# Altium schematic sheet MAIN.SchDoc: Node ABZ (part 2 of 2)
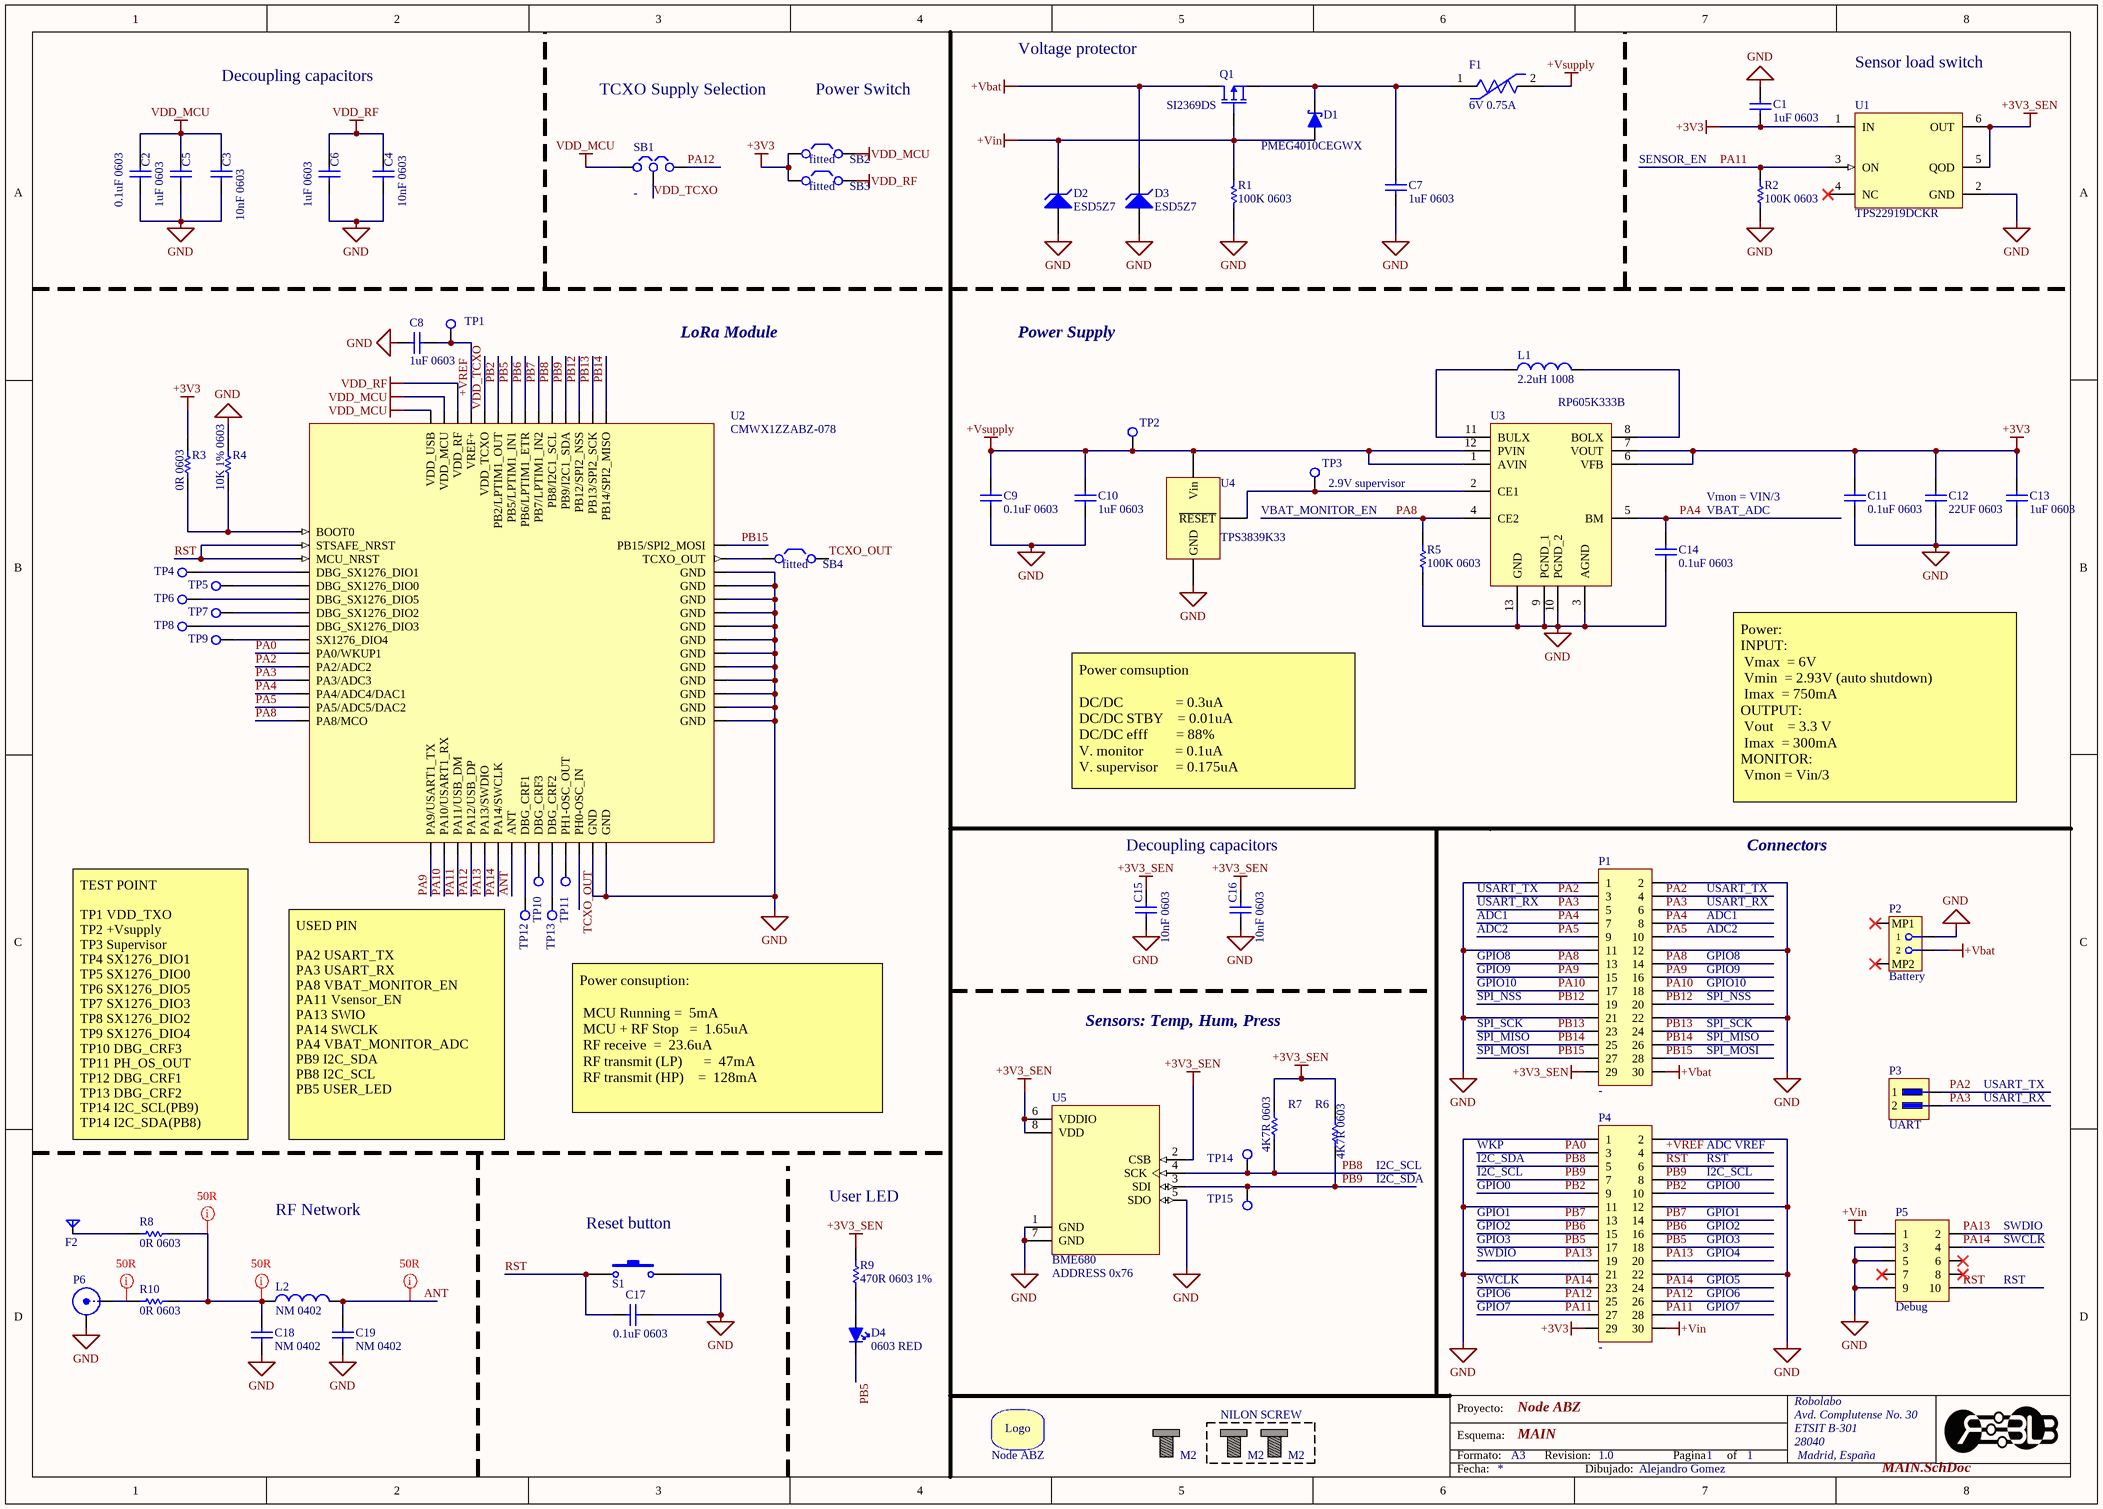
[diagram p1: MAIN.SchDoc]

## Library data of the parts
C1 C5-C8 C10 C13 = C0603C105K8PACTU: CAP CER, 1UF, 10V, X5R, 10%, 0603; Manufacturer: KEMET; Dielectric Material: Ceramic; Supplier 1: Digi-Key; Supplier Part Number 1: 399-3118-1-ND; Manufacturer Part Number: C0603C105K8PACTU; RoHS: Yes; Category: Ceramic Capacitors; Stock 1: 39312; Pricing 1: 1=0.10000, 10=0.05900, 50=0.03200, 100=0.02610, 500=0.01864, 1000=0.01464 (USD); Mount: Surface Mount; Case/Package: 0603; Number of Pins: 2; Weight: 7.1E-05oz; Case Code (Imperial): 0603; Case Code (Metric): 1608; Min Operating Temperature: -55°C; Max Operating Temperature: 85°C; Tolerance: 10%; Capacitance: 1uF; Packaging: Tape and Reel; Dielectric: X5R; Package Quantity: 1; Voltage Rating: 10V; Voltage Rating (DC): 10V; Termination: SMD/SMT; Voltage: 10V; Length: 1.6mm; Height: 0.8mm; Depth: 0.8mm; Width: 0.031inch; Thickness: 0.035inch; Radiation Hardening: No; REACH SVHC: No SVHC; Lead Free: Lead Free; ComponentLink1URL: https://datasheet.ciiva.com/11787/0900766b8116eb59-11787747.pdf?src-supplier=RSComponents; ComponentLink1Description: https://datasheet.ciiva.com/11787/0900766b8116eb59-11787747.pdf?src-supplier=RSComponents; ComponentLink2URL: https://datasheet.ciiva.com/6074/40889-6074647.pdf?src-supplier=Farnell; ComponentLink2Description: https://datasheet.ciiva.com/6074/40889-6074647.pdf?src-supplier=Farnell; ComponentLink3URL: https://datasheet.ciiva.com/28645/1831760-28645655.pdf?src-supplier=Element14; ComponentLink3Description: https://datasheet.ciiva.com/28645/1831760-28645655.pdf?src-supplier=Element14; ComponentLink4URL: https://datasheet.ciiva.com/26847/getdatasheetpartid-385480-26847548.pdf?src-supplier=Verical; ComponentLink4Description: https://datasheet.ciiva.com/26847/getdatasheetpartid-385480-26847548.pdf?src-supplier=Verical; ComponentLink5URL: https://datasheet.ciiva.com/7823/40889-7823998.pdf?src-supplier=Element14; ComponentLink5Description: https://datasheet.ciiva.com/7823/40889-7823998.pdf?src-supplier=Element14; ComponentLink6URL: https://datasheet.ciiva.com/7823/1929483-7823999.pdf?src-supplier=Element14; ComponentLink6Description: https://datasheet.ciiva.com/7823/1929483-7823999.pdf?src-supplier=Element14
C2 C17 = C0603C104K9RACTU: Cap Ceramic 0.1uF 6.3V X7R 10% Pad SMD 0603 125°C T/R; Manufacturer 1: KEMET; Capacitance: 100nF; Dissipation Factor: 5%; Supplier 1: Mouser; Manufacturer Part Number 1: C0603C104K9RACTU; RoHS: Yes; Category: Ceramic Capacitors; Stock 1: 22809; Pricing 1: 1=0,19000, 10=0,13800, 100=0,04500, 1000=0,03700, 4000=0,02700, 8000=0,02400 (USD); Mount: Surface Mount; Case/Package: 0603; Case Code (Imperial): 0603; Case Code (Metric): 1608; Dielectric Material: Ceramic; Min Operating Temperature: -55°C; Max Operating Temperature: 125°C; Package Quantity: 4000; Voltage Rating: 6.3V; Tolerance: 10%; Packaging: Tape and Reel; Voltage Rating (DC): 6.3V; Dielectric: X7R; Termination: SMD/SMT; Length: 1.6mm; Height: 0.8mm; Width: 0.8mm; Depth: 0.8mm; Thickness: 0.034inch; Radiation Hardening: No; ComponentLink1URL: https://datasheet.ciiva.com/13371/kem-c1002-x7r-smd-357932-13371879.pdf?src-supplier=Mouser; ComponentLink1Description: https://datasheet.ciiva.com/13371/kem-c1002-x7r-smd-357932-13371879.pdf?src-supplier=Mouser; Supplier Part Number 1: 80-C0603C104K9R
C3 C4 C15 C16 = C0603C103K5RACTU: Multilayer Ceramic Capacitor, C Series, 0.01 - F, - 10%, X7R, 50 V, 0603 [1608 Metric] ;RoHS Compliant: Yes; Manufacturer: KEMET; Voltage Rating: 50V; Dissipation Factor: 2.5%; Supplier 1: Digi-Key; RoHS: Yes; Category: Ceramic Capacitors; Stock 1: 2415850; Pricing 1: 1=0.11000, 10=0.07700, 50=0.04220, 100=0.03440, 500=0.02456, 1000=0.01930 (USD); Mount: Surface Mount,PCB; Case/Package: 0603; Case Code (Metric): 1608; Case Code (Imperial): 0603; Dielectric Material: Ceramic; Min Operating Temperature: -55°C; Max Operating Temperature: 125°C; Capacitance: 10nF; Tolerance: 10%; Packaging: Tape and Reel; Package Quantity: 4000; Voltage Rating (DC): 50V; Dielectric: X7R; Termination: SMD/SMT; Length: 1.6mm; Height: 0.8mm; Width: 0.8mm; Depth: 0.8mm; Thickness: 0.034inch; ComponentLink1URL: https://datasheet.ciiva.com/7823/1732718-7823585.pdf?src-supplier=Element14; ComponentLink1Description: https://datasheet.ciiva.com/7823/1732718-7823585.pdf?src-supplier=Element14; Supplier Part Number 1: 399-1091-1-ND; Manufacturer Part Number: C0603C103K5RACTU; Number of Pins: 2; Contact Plating: Tin,Matte; Voltage: 50V; Lead Pitch: 0.7mm; Radiation Hardening: No; REACH SVHC: No SVHC; ComponentLink2URL: https://datasheet.ciiva.com/5904/kem-c1002-x7r-smd-5904645.pdf?src-supplier=Farnell; ComponentLink2Description: https://datasheet.ciiva.com/5904/kem-c1002-x7r-smd-5904645.pdf?src-supplier=Farnell; ComponentLink3URL: https://datasheet.ciiva.com/18192/getdatasheetpartid-308803-18192662.pdf?src-supplier=Verical; ComponentLink3Description: https://datasheet.ciiva.com/18192/getdatasheetpartid-308803-18192662.pdf?src-supplier=Verical; ComponentLink4URL: https://datasheet.ciiva.com/39122/kem-c1002-x7r-smd-39122903.pdf?src-supplier=Onlinecomponents.com; ComponentLink4Description: https://datasheet.ciiva.com/39122/kem-c1002-x7r-smd-39122903.pdf?src-supplier=Onlinecomponents.com; ComponentLink5URL: https://datasheet.ciiva.com/7823/kem-c1002-x7r-smd-7823976.pdf?src-supplier=Element14; ComponentLink5Description: https://datasheet.ciiva.com/7823/kem-c1002-x7r-smd-7823976.pdf?src-supplier=Element14; ComponentLink6URL: https://datasheet.ciiva.com/7823/kem-c1002-x7r-smd-7823977.pdf?src-supplier=Element14; ComponentLink6Description: https://datasheet.ciiva.com/7823/kem-c1002-x7r-smd-7823977.pdf?src-supplier=Element14; ComponentLink7URL: https://datasheet.ciiva.com/7823/1918693-7823978.pdf?src-supplier=Element14; ComponentLink7Description: https://datasheet.ciiva.com/7823/1918693-7823978.pdf?src-supplier=Element14; ComponentLink8URL: https://datasheet.ciiva.com/14585/70095383-14585450.pdf?src-supplier=Allied+Electronics; ComponentLink8Description: https://datasheet.ciiva.com/14585/70095383-14585450.pdf?src-supplier=Allied+Electronics; ComponentLink9URL: https://datasheet.ciiva.com/18101/getdatasheetpartid-58468-18101898.pdf?src-supplier=Verical; ComponentLink9Description: https://datasheet.ciiva.com/18101/getdatasheetpartid-58468-18101898.pdf?src-supplier=Verical; ComponentLink10URL: https://datasheet.ciiva.com/5416/kem-c1002-x7r-smd-5416028.pdf?src-supplier=Mouser; ComponentLink10Description: https://datasheet.ciiva.com/5416/kem-c1002-x7r-smd-5416028.pdf?src-supplier=Mouser; ComponentLink11URL: https://datasheet.ciiva.com/28645/1851736-28645598.pdf?src-supplier=Element14; ComponentLink11Description: https://datasheet.ciiva.com/28645/1851736-28645598.pdf?src-supplier=Element14
C9 C11 C14 = C0603C104K9RACTU: CAP CER, 0.1UF, 6.3V, X7R, 10%, 0603; Manufacturer 1: KEMET; Dielectric Material: Ceramic; Capacitance: 100nF; Dissipation Factor: 5%; Supplier 1: Mouser; Manufacturer Part Number 1: C0603C104K9RACTU; RoHS: Yes; Category: Ceramic Capacitors; Stock 1: 22809; Pricing 1: 1=0,19000, 10=0,13800, 100=0,04500, 1000=0,03700, 4000=0,02700, 8000=0,02400 (USD); Mount: Surface Mount; Case/Package: 0603; Case Code (Imperial): 0603; Case Code (Metric): 1608; Min Operating Temperature: -55°C; Max Operating Temperature: 125°C; Package Quantity: 4000; Voltage Rating: 6.3V; Tolerance: 10%; Packaging: Tape and Reel; Voltage Rating (DC): 6.3V; Dielectric: X7R; Termination: SMD/SMT; Length: 1.6mm; Height: 0.8mm; Width: 0.8mm; Depth: 0.8mm; Thickness: 0.034inch; Radiation Hardening: No; ComponentLink1URL: https://datasheet.ciiva.com/13371/kem-c1002-x7r-smd-357932-13371879.pdf?src-supplier=Mouser; ComponentLink1Description: https://datasheet.ciiva.com/13371/kem-c1002-x7r-smd-357932-13371879.pdf?src-supplier=Mouser; Supplier Part Number 1: 80-C0603C104K9R
C12 = C0603C300G1HACTU: CAP CER, 22UF, 100V, X8R, 2%, 0603; Manufacturer: KEMET; Supplier 1: Mouser; Supplier Part Number 1: 80-C0603C300G1HACTU; Manufacturer Part Number: C0603C300G1HACTU; RoHS: Yes; Category: Ceramic Capacitors; Stock 1: 11458; Pricing 1: 1=0.04000, 10=0.02900, 50=0.02900, 100=0.02500, 1000=0.01400, 10000=0.01200 (USD); RoHS Compliant: Yes
C18 C19 = C0603C103K9RACTU: NM; Manufacturer 1: KEMET; Dielectric Material: Ceramic; Capacitance: 10nF; Tolerance: 10%; Voltage Rating: 6.3V; Dielectric: X7R; Dissipation Factor: 5%; Supplier 1: Mouser; Manufacturer Part Number 1: C0603C103K9RACTU; RoHS: Yes; Category: Ceramic Capacitors; Stock 1: 18988; Pricing 1: 1=0,11000, 10=0,07600, 100=0,02400, 1000=0,02000, 4000=0,01600, 8000=0,01400 (USD); Mount: Surface Mount; Case/Package: 0603; Case Code (Metric): 1608; Case Code (Imperial): 0603; Min Operating Temperature: -55°C; Max Operating Temperature: 125°C; Packaging: Tape and Reel; Package Quantity: 1; Voltage Rating (DC): 6.3V; Termination: SMD/SMT; Length: 1.6mm; Height: 0.8mm; Width: 0.031inch; Depth: 0.8mm; Thickness: 0.034inch; ComponentLink1URL: https://datasheet.ciiva.com/5421/kem-c1002-x7r-smd-357932-5421815.pdf?src-supplier=Mouser; ComponentLink1Description: https://datasheet.ciiva.com/5421/kem-c1002-x7r-smd-357932-5421815.pdf?src-supplier=Mouser; Supplier Part Number 1: 80-C0603C103K9R
D1 = PMEG4010CEGWX: DIODE SCHOTTKY 40V 1A 570mV SOD123; Manufacturer: Nexperia; Supplier 1: Mouser; Supplier Part Number 1: 841-PMEG4010CEGWX; Manufacturer Part Number: PMEG4010CEGWX; RoHS: No; Category: Schottky Diodes; Stock 1: 3187; Pricing 1: 1=0.29000, 10=0.19400, 50=0.19400, 100=0.09100, 1000=0.05400, 10000=0.03500 (USD); RoHS Compliant: No; ComponentLink1URL: http://www.farnell.com/datasheets/2290154.pdf?src-supplier=Farnell; ComponentLink1Description: http://www.farnell.com/datasheets/2290154.pdf?src-supplier=Farnell; ComponentLink2URL: https://assets.nexperia.com/documents/data-sheet/PMEG4010CEGW.pdf?src-supplier=Digi-Key; ComponentLink2Description: https://assets.nexperia.com/documents/data-sheet/PMEG4010CEGW.pdf?src-supplier=Digi-Key; ComponentLink3URL: http://www.farnell.com/datasheets/2290154.pdf?src-supplier=Element14; ComponentLink3Description: http://www.farnell.com/datasheets/2290154.pdf?src-supplier=Element14; ComponentLink4URL: http://www.farnell.com/datasheets/2290154.pdf?src-supplier=Newark; ComponentLink4Description: http://www.farnell.com/datasheets/2290154.pdf?src-supplier=Newark
D2 D3 = ESD5Z7.0T1G: TVS Diodes / ESD Suppressors SOD523 ESD DIODE; Manufacturer: ON Semiconductor; Operating Supply Voltage: 7V; Number of Elements: 1; Capacitance: 65pF; Reverse Breakdown Voltage: 7.5V; Max Surge Current: 8.8A; Direction: Unidirectional; Clamping Voltage: 22.7V; Peak Pulse Power: 200W; Power Line Protection: No; ESD Protection: Yes; Max Reverse Leakage Current: 10nA; Test Current: 1mA; Max Power Dissipation: 240W; Element Configuration: Single; Diode Type: ZENER; Supplier 1: Mouser; Supplier Part Number 1: 863-ESD5Z7.0T1G; Manufacturer Part Number: ESD5Z7.0T1G; RoHS: Yes; Category: ESD and Circuit Protection ICs; Stock 1: 23017; Pricing 1: 1=0.17000, 10=0.11700, 50=0.11700, 100=0.05000, 1000=0.03500, 10000=0.02300 (USD); Case/Package: SOD-523-2; Number of Pins: 2; Contact Plating: Tin,Matte; Min Operating Temperature: -55°C; Max Operating Temperature: 150°C; Package Quantity: 1; Number of Channels: 1; Packaging: Tape and Reel; Number of Unidirectional Channels: 1; Reverse Standoff Voltage: 7V; Min Breakdown Voltage: 7.5V; Polarity: Unidirectional; Breakdown Voltage: 7.5V; Termination: SMD/SMT; Working Voltage: 7V; Max Breakdown Voltage: 7.5V; Leakage Current: 10nA; Peak Pulse Current: 8.8A; Number of Lines: 1; Resistor Type: Zener; Series: Automotive, AEC-Q101; Clamping Voltage-Max: 22.7V; Length: 1.2mm; Width: 0.9mm; Height: 0.7mm; Depth: 0.8mm; Radiation Hardening: No; REACH SVHC: No SVHC; Lead Free: Lead Free; Halogen Free: Halogen Free; RoHS Compliant: Yes; ComponentLink1URL: https://datasheet.ciiva.com/353/esd5z2-5t1-d-353760.pdf?src-supplier=Digi-Key; ComponentLink1Description: https://datasheet.ciiva.com/353/esd5z2-5t1-d-353760.pdf?src-supplier=Digi-Key; ComponentLink2URL: https://datasheet.ciiva.com/30478/0900766b8125092b-30478674.pdf?src-supplier=RSComponents; ComponentLink2Description: https://datasheet.ciiva.com/30478/0900766b8125092b-30478674.pdf?src-supplier=RSComponents; ComponentLink3URL: https://datasheet.ciiva.com/353/esd5z2-5t1-d-353761.pdf?src-supplier=Digi-Key; ComponentLink3Description: https://datasheet.ciiva.com/353/esd5z2-5t1-d-353761.pdf?src-supplier=Digi-Key; ComponentLink4URL: https://datasheet.ciiva.com/11195/esd5z2-5t1-d-11195333.pdf?src-supplier=Avnet; ComponentLink4Description: https://datasheet.ciiva.com/11195/esd5z2-5t1-d-11195333.pdf?src-supplier=Avnet; ComponentLink5URL: https://datasheet.ciiva.com/16437/esd5z2-5t1-d-16437829.pdf?src-supplier=Future+Electronics; ComponentLink5Description: https://datasheet.ciiva.com/16437/esd5z2-5t1-d-16437829.pdf?src-supplier=Future+Electronics; ComponentLink6URL: https://datasheet.ciiva.com/7973/esd5z2-5t1-d-7973851.pdf?src-supplier=Element14; ComponentLink6Description: https://datasheet.ciiva.com/7973/esd5z2-5t1-d-7973851.pdf?src-supplier=Element14; ComponentLink7URL: https://datasheet.ciiva.com/26817/getdatasheetpartid-120991-26817819.pdf?src-supplier=Verical; ComponentLink7Description: https://datasheet.ciiva.com/26817/getdatasheetpartid-120991-26817819.pdf?src-supplier=Verical; ComponentLink8URL: https://datasheet.ciiva.com/353/esd5z2-5t1-d-353759.pdf?src-supplier=Digi-Key; ComponentLink8Description: https://datasheet.ciiva.com/353/esd5z2-5t1-d-353759.pdf?src-supplier=Digi-Key
D4 = KPG1-1608SURC-TT: Led, Red, 65MCD, 631NM, SMD, 1608; Manufacturer: Kingbright; Supplier 1: RSComponents; RoHS: No; Stock 1: 2675; Pricing 1: 25=0.16500 (USD); ComponentLink1URL: http://www.farnell.com/datasheets/2163487.pdf?src-supplier=Farnell; ComponentLink1Description: http://www.farnell.com/datasheets/2163487.pdf?src-supplier=Farnell; Supplier Part Number 1: 1254508; Manufacturer Part Number: KPG1-1608SURC-TT
F1 = 0ZCK0075FF2E: BEL FUSE - 0ZCK0075FF2E - FUSE, RESETTABLE PTC, 6VDC, 0.75A, SMD; Max Current Rating: 40A; Hold Current: 750mA; Trip Current: 1.5A; Time to Trip: 0.2s; Supplier 1: Mouser; Supplier Part Number 1: 530-0ZCK0075FF2E; Manufacturer: Bel; RoHS: Yes; Category: PTC Resettable Fuses; Stock 1: 8730; Pricing 1: 1=0.17000, 10=0.17000, 50=0.12300, 100=0.10900, 1000=0.08600, 10000=0.07300 (USD); Case/Package: 0805; Case Code (Metric): 2012; Case Code (Imperial): 0805; Package Quantity: 1; Packaging: Tape and Reel; Lead Free: Lead Free; RoHS Compliant: Yes; ComponentLink1URL: https://datasheet.ciiva.com/18550/0zck-18550716.pdf?src-supplier=Digi-Key; ComponentLink1Description: https://datasheet.ciiva.com/18550/0zck-18550716.pdf?src-supplier=Digi-Key; ComponentLink2URL: https://datasheet.ciiva.com/18550/0zck-18550717.pdf?src-supplier=Digi-Key; ComponentLink2Description: https://datasheet.ciiva.com/18550/0zck-18550717.pdf?src-supplier=Digi-Key; Manufacturer Part Number: 0ZCK0075FF2E
F2 = Helical_868-915MHZ: 19x11mm Helical antenna. Requieres load matching  (impedance at 868MHz: 10-88j, VSWR 22)
L1 = CVH252009-2R2M: 2.2uH, 1.3A , 20%, 1MHz; Manufacturer: Bourns; Core Material: Ferrite; Shielding: Shielded; Self Resonant Frequency: 40MHz; DC Resistance (DCR): 80mR; Supplier 1: Mouser; Supplier Part Number 1: 652-CVH252009-2R2M; Manufacturer Part Number: CVH252009-2R2M; RoHS: Yes; Category: Fixed Inductors; Stock 1: 41990; Pricing 1: 1=0.23000, 10=0.18800, 50=0.16900, 100=0.15800, 1000=0.11100, 10000=0.08000 (USD); Mount: Surface Mount; Case/Package: 1008; Case Code (Metric): 2520; Case Code (Imperial): 1008; Contact Plating: Tin; Min Operating Temperature: -55°C; Max Operating Temperature: 125°C; Package Quantity: 3000; Current Rating: 1.3A; Tolerance: 20%; Packaging: Tape and Reel; Inductance Tolerance: 20%; Inductance: 2.2uH; Test Frequency: 1MHz; Max DC Current: 1.3A; Termination: SMD/SMT; DC Current: 1.3A; Series: CVH252009; Length: 0.098inch; Width: 0.079inch; Height - Seated (Max): 0.039inch; Depth: 2.2mm; REACH SVHC: No SVHC; Military Standard: Not; RoHS Compliant: Yes; ComponentLink1URL: https://datasheet.ciiva.com/6703/cvh25200920series-6703456.pdf?src-supplier=Digi-Key; ComponentLink1Description: https://datasheet.ciiva.com/6703/cvh25200920series-6703456.pdf?src-supplier=Digi-Key; ComponentLink2URL: https://datasheet.ciiva.com/3079/cvh-3079746.pdf?src-supplier=Avnet; ComponentLink2Description: https://datasheet.ciiva.com/3079/cvh-3079746.pdf?src-supplier=Avnet; ComponentLink3URL: https://datasheet.ciiva.com/7849/1610598-7849317.pdf?src-supplier=Element14; ComponentLink3Description: https://datasheet.ciiva.com/7849/1610598-7849317.pdf?src-supplier=Element14; ComponentLink4URL: https://datasheet.ciiva.com/22874/70301233-22874395.pdf?src-supplier=Allied+Electronics; ComponentLink4Description: https://datasheet.ciiva.com/22874/70301233-22874395.pdf?src-supplier=Allied+Electronics; ComponentLink5URL: https://datasheet.ciiva.com/6703/cvh252009series-6703455.pdf?src-supplier=Digi-Key; ComponentLink5Description: https://datasheet.ciiva.com/6703/cvh252009series-6703455.pdf?src-supplier=Digi-Key
L2 = 2506031217Z0: NM; Manufacturer: Fair-Rite; Impedance: 120 Ohms; Maximum DC Current: 450 mA; Maximum DC Resistance: 300 mOhms; Tolerance: 25 %; Type: Multilayer Ferrite Chip Bead; Test Frequency: 100 MHz; Supplier 1: Mouser; Manufacturer Part Number: 2506031217Z0; RoHS: RoHS Compliant; Category: Ferrite Beads; Stock 1: 9619; Pricing 1: 1=0.032, 2500=0.027, 4000=0.025, 8000=0.024, 24000=0.022, 48000=0.021, 100000=0.018, 400000=0.016 (EUR); Capacitance: -; Height: 0.8 mm; Length: 1.6 mm; Operating Temperature Range: - 55 C to + 125 C; Package / Case: 0603 (1608 metric); Packaging: Cut Tape; Product: Ferrite Chip Beads; Termination Style: SMD/SMT; Width: 0.8 mm; Brand: Fair-Rite; Maximum Operating Temperature: + 125 C; Minimum Operating Temperature: - 55 C; Product Type: Ferrite Beads; Standard Pack Qty: 4000; Subcategory: Ferrites; Termination: -; RoHS - Mouser: Y; Minimum Order Quantity: 1; Reeling: True; ComponentLink1URL: https://www.mouser.com/datasheet/2/150/2506031217Z0-471794.pdf; ComponentLink1Description: https://www.mouser.com/datasheet/2/150/2506031217Z0-471794.pdf; Supplier Part Number 1: 623-2506031217Z0
logo1 = Robolabo
P1 P4 = CONN-2X15-1.27-MALE-RECT
P2 = S2B-PH-SM4-TB: CONN MALE RECT 2 POS 2mm
P3 = CONN-1X2-2.54-PCB
P5 = CONN-2X5-1.27-MALE-RECT
P6 = 73412-0110: MOLEX   73412-0110   RF COAXIAL, MICROCOAXIAL, JACK, 50OHM; Impedance: 50R; Voltage Rating: 60V; Frequency: 6GHz; Gender: Female; Polarity: Standard; Body Material: Polymer,Liquid Crystal Polymer; Body Plating: Gold; Insulation Resistance: 500MR; Mating Cycles: 30; Supplier 1: Digi-Key; Stock 1: 98770; Pricing 1: 1=0.77000, 10=0.72200, 25=0.64960, 50=0.57740, 100=0.55330, 250=0.50520, 500=0.48114, 1000=0.39694, 2500=0.36086 (USD); RoHS: Yes; ComponentLink1URL: https://datasheet.ciiva.com/30219/250360734120110-rf-coax-nectors-30219809.pdf?src-supplier=Onlinecomponents.com; ComponentLink1Description: https://datasheet.ciiva.com/30219/250360734120110-rf-coax-nectors-30219809.pdf?src-supplier=Onlinecomponents.com; Supplier Part Number 1: WM5587CT-ND; Manufacturer: Molex; Manufacturer Part Number: 73412-0110; Category: RF / Coaxial Connectors; Mount: Surface Mount,Through Hole,PCB; Contact Material: Bronze,Brass; Contact Plating: Gold; Min Operating Temperature: -40°C; Max Operating Temperature: 90°C; Package Quantity: 5000; Packaging: Tape and Reel; Termination: Solder; Connector Type: Coaxial; Orientation: Straight; Voltage Rating (AC): 60V; Radiation Hardening: No; REACH SVHC: Unknown; Lead Free: Lead Free; ComponentLink2URL: https://datasheet.ciiva.com/16653/0734120110-rf-coax-connectors-16653186.pdf?src-supplier=Avnet+Europe; ComponentLink2Description: https://datasheet.ciiva.com/16653/0734120110-rf-coax-connectors-16653186.pdf?src-supplier=Avnet+Europe; ComponentLink3URL: https://datasheet.ciiva.com/11762/0900766b80dfdeb4-11762356.pdf?src-supplier=RSComponents; ComponentLink3Description: https://datasheet.ciiva.com/11762/0900766b80dfdeb4-11762356.pdf?src-supplier=RSComponents; ComponentLink4URL: https://datasheet.ciiva.com/22773/1841262-22773140.pdf?src-supplier=Farnell; ComponentLink4Description: https://datasheet.ciiva.com/22773/1841262-22773140.pdf?src-supplier=Farnell; ComponentLink5URL: https://datasheet.ciiva.com/4600/0734120110-rf-coax-connectors-173239-4600647.pdf?src-supplier=Mouser; ComponentLink5Description: https://datasheet.ciiva.com/4600/0734120110-rf-coax-connectors-173239-4600647.pdf?src-supplier=Mouser; ComponentLink6URL: https://datasheet.ciiva.com/16081/1387750734120110-rf-coax-nectors-16081145.pdf?src-supplier=Onlinecomponents.com; ComponentLink6Description: https://datasheet.ciiva.com/16081/1387750734120110-rf-coax-nectors-16081145.pdf?src-supplier=Onlinecomponents.com; ComponentLink7URL: https://datasheet.ciiva.com/46384/1808577-46384459.pdf?src-supplier=Element14; ComponentLink7Description: https://datasheet.ciiva.com/46384/1808577-46384459.pdf?src-supplier=Element14; ComponentLink8URL: https://datasheet.ciiva.com/9419/0734120110-rf-coax-connectors-9419357.pdf?src-supplier=Avnet; ComponentLink8Description: https://datasheet.ciiva.com/9419/0734120110-rf-coax-connectors-9419357.pdf?src-supplier=Avnet; Halogen Free: Low Halogen; Material: Bronze; Max Frequency: 6GHz
Q1 = SI2369DS-T1-GE3: VISHAY - SI2369DS-T1-GE3 - MOSFET, P-CH, -30V, -7.6A, 150DEG C; Manufacturer: Vishay Siliconix; Drain to Source Voltage (Vdss): 30V; Max Power Dissipation: 2.5W; Number of Channels: 1; Drain to Source Resistance: 29mR; Input Capacitance: 1.295nF; Gate to Source Voltage (Vgs): 20V; Supplier 1: Mouser; Supplier Part Number 1: 78-SI2369DS-T1-GE3; Manufacturer Part Number: SI2369DS-T1-GE3; RoHS: Yes; Category: MOSFETs; Stock 1: 37245; Pricing 1: 1=0.36000, 10=0.32600, 100=0.24200, 500=0.19900, 1000=0.15300, 3000=0.14000 (USD); Mount: Surface Mount; Case/Package: TO-236-3; Number of Pins: 3; Contact Plating: Tin,Matte; Min Operating Temperature: -55°C; Max Operating Temperature: 150°C; Continuous Drain Current (ID): -7.6A; Drain to Source Breakdown Voltage: 30V; Package Quantity: 3000; Packaging: Tape and Reel; Rds On Max: 29mR; Radiation Hardening: No; REACH SVHC: No SVHC; ComponentLink1URL: https://datasheet.ciiva.com/29747/si2369d-29747874.pdf?src-supplier=Digi-Key; ComponentLink1Description: https://datasheet.ciiva.com/29747/si2369d-29747874.pdf?src-supplier=Digi-Key; ComponentLink2URL: https://datasheet.ciiva.com/29747/si2369d-29747879.pdf?src-supplier=Digi-Key; ComponentLink2Description: https://datasheet.ciiva.com/29747/si2369d-29747879.pdf?src-supplier=Digi-Key
R1 R2 R5 = CRCW0603100KFKEAHP: RES SMD 100K OHM 1% 1/10W 0603; Manufacturer: Vishay; Temperature Coefficient: 100ppm/°C; Resistance: 100kR; Max Power Dissipation: 250mW; Voltage Rating: 75V; Supplier 1: Digi-Key; Supplier Part Number 1: 541-100KSCT-ND; Manufacturer Part Number: CRCW0603100KFKEAHP; RoHS: Yes; Category: Chip SMD Resistors; Stock 1: 8564; Pricing 1: 1=0.16000, 10=0.13600, 100=0.05330, 1000=0.02232, 2500=0.02046 (USD); Case/Package: 0603; Weight: 7.1E-05oz; Contact Plating: Tin; Case Code (Imperial): 0603; Case Code (Metric): 1608; Min Operating Temperature: -55°C; Max Operating Temperature: 155°C; Tolerance: 1%; Composition: Thick Film; Features: Automotive AEC-Q200; Power Rating: 250mW; Packaging: Tape and Reel; Package Quantity: 10; Number of Terminations: 2; Termination: SMD/SMT; Military Standard: Not; Voltage Rating (DC): 75V; Length: 1.6mm; Height: 0.45mm; Width: 0.8mm; Depth: 0.85mm; Radiation Hardening: No; REACH SVHC: Unknown; Lead Free: Lead Free; ComponentLink1URL: https://datasheet.ciiva.com/3256/crcwhpe3-3256918.pdf?src-supplier=Avnet; ComponentLink1Description: https://datasheet.ciiva.com/3256/crcwhpe3-3256918.pdf?src-supplier=Avnet; ComponentLink2URL: https://datasheet.ciiva.com/2472/crcwhpe3-2472535.pdf?src-supplier=Digi-Key; ComponentLink2Description: https://datasheet.ciiva.com/2472/crcwhpe3-2472535.pdf?src-supplier=Digi-Key; ComponentLink3URL: https://datasheet.ciiva.com/2472/crcwhpe3-2472536.pdf?src-supplier=Digi-Key; ComponentLink3Description: https://datasheet.ciiva.com/2472/crcwhpe3-2472536.pdf?src-supplier=Digi-Key; ComponentLink4URL: https://datasheet.ciiva.com/16211/crcwhpe3-16211869.pdf?src-supplier=Future+Electronics; ComponentLink4Description: https://datasheet.ciiva.com/16211/crcwhpe3-16211869.pdf?src-supplier=Future+Electronics; ComponentLink5URL: https://datasheet.ciiva.com/7777/424479-7777270.pdf?src-supplier=Element14; ComponentLink5Description: https://datasheet.ciiva.com/7777/424479-7777270.pdf?src-supplier=Element14; ComponentLink6URL: https://datasheet.ciiva.com/7777/424479-7777271.pdf?src-supplier=Element14; ComponentLink6Description: https://datasheet.ciiva.com/7777/424479-7777271.pdf?src-supplier=Element14; ComponentLink7URL: https://datasheet.ciiva.com/2472/crcwhpe3-2472537.pdf?src-supplier=Digi-Key; ComponentLink7Description: https://datasheet.ciiva.com/2472/crcwhpe3-2472537.pdf?src-supplier=Digi-Key
R3 R8 R10 = CRCW0603-0000Z0EA: RES SMD 0 OHM 0603; Manufacturer 1: Vishay; Resistance: 0mR; Power Rating: 100mW; Voltage Rating: 75V; Temperature Coefficient: 100ppm/°C; Tolerance: 5%; Current Rating: 2A; Supplier 1: Mouser; Stock 1: 1187486; Pricing 1: 1=0,100000, 10=0,017000, 100=0,012000, 500=0,007000, 1000=0,006000, 2500=0,005000, 5000=0,004000, 10000=0,003000 (USD); RoHS: Yes; Case/Package: 0603; Weight: 7.1E-05oz; Case Code (Metric): 1608; Case Code (Imperial): 0603; Contact Plating: Tin,Lead; Min Operating Temperature: -55°C; Max Operating Temperature: 155°C; Packaging: Tape and Reel; Composition: Thick Film; Voltage Rating (DC): 75V; Military Standard: Not; Package Quantity: 1; Termination: SMD/SMT; Max Power Dissipation: 100mW; Number of Terminations: 2; Features: Automotive AEC-Q200; Length: 1.55mm; Height: 0.02inch; Width: 0.033inch; Depth: 0.85mm; Radiation Hardening: No; REACH SVHC: Unknown; Lead Free: Lead Free; ComponentLink1URL: https://datasheet.ciiva.com/2461/dcrcwe3-2461968.pdf?src-supplier=Digi-Key; ComponentLink1Description: https://datasheet.ciiva.com/2461/dcrcwe3-2461968.pdf?src-supplier=Digi-Key; ComponentLink2URL: https://datasheet.ciiva.com/2461/dcrcwe3-2461969.pdf?src-supplier=Digi-Key; ComponentLink2Description: https://datasheet.ciiva.com/2461/dcrcwe3-2461969.pdf?src-supplier=Digi-Key; ComponentLink3URL: https://datasheet.ciiva.com/2461/dcrcwe3-2461970.pdf?src-supplier=Digi-Key; ComponentLink3Description: https://datasheet.ciiva.com/2461/dcrcwe3-2461970.pdf?src-supplier=Digi-Key; ComponentLink4URL: https://datasheet.ciiva.com/8340/dcrcwe3-8340197.pdf?src-supplier=Avnet; ComponentLink4Description: https://datasheet.ciiva.com/8340/dcrcwe3-8340197.pdf?src-supplier=Avnet; ComponentLink5URL: https://datasheet.ciiva.com/16941/dcrcw-16941302.pdf?src-supplier=Avnet+Europe; ComponentLink5Description: https://datasheet.ciiva.com/16941/dcrcw-16941302.pdf?src-supplier=Avnet+Europe; Supplier Part Number 1: 71-CRCW0603-0-E3; Manufacturer Part Number 1: CRCW0603-0000Z0EA; Mount: Surface Mount; Working Voltage: 75V; ComponentLink6URL: https://datasheet.ciiva.com/16199/dcrcwe3-16199063.pdf?src-supplier=Future+Electronics; ComponentLink6Description: https://datasheet.ciiva.com/16199/dcrcwe3-16199063.pdf?src-supplier=Future+Electronics; ComponentLink7URL: https://datasheet.ciiva.com/16725/70201119-16725175.pdf?src-supplier=Allied+Electronics; ComponentLink7Description: https://datasheet.ciiva.com/16725/70201119-16725175.pdf?src-supplier=Allied+Electronics; ComponentLink8URL: https://datasheet.ciiva.com/26316/fld-crcw-e3-data-en-26316615.pdf?src-supplier=Distrelec; ComponentLink8Description: https://datasheet.ciiva.com/26316/fld-crcw-e3-data-en-26316615.pdf?src-supplier=Distrelec; ComponentLink9URL: https://datasheet.ciiva.com/5544/dcrcwe3-109170-5544344.pdf?src-supplier=Mouser; ComponentLink9Description: https://datasheet.ciiva.com/5544/dcrcwe3-109170-5544344.pdf?src-supplier=Mouser; ComponentLink10URL: https://datasheet.ciiva.com/7841/1720486-7841816.pdf?src-supplier=Element14; ComponentLink10Description: https://datasheet.ciiva.com/7841/1720486-7841816.pdf?src-supplier=Element14; ComponentLink11URL: https://datasheet.ciiva.com/7841/1720486-7841817.pdf?src-supplier=Element14; ComponentLink11Description: https://datasheet.ciiva.com/7841/1720486-7841817.pdf?src-supplier=Element14; ComponentLink12URL: https://datasheet.ciiva.com/7841/125364-7841818.pdf?src-supplier=Element14; ComponentLink12Description: https://datasheet.ciiva.com/7841/125364-7841818.pdf?src-supplier=Element14; ComponentLink13URL: https://datasheet.ciiva.com/16721/70201119-16721450.pdf?src-supplier=Allied+Electronics; ComponentLink13Description: https://datasheet.ciiva.com/16721/70201119-16721450.pdf?src-supplier=Allied+Electronics
R4 = CRCW060310K0FKEA: RES SMD 10K OHM 1% 1/10W 0603; Manufacturer: Vishay; Resistance: 10kR; Temperature Coefficient: 100ppm/°C; Voltage Rating (DC): 75V; Power Rating: 100mW; Supplier 1: Digi-Key; Stock 1: 633553; Pricing 1: 1=0.10000, 10=0.03300, 100=0.01340, 1000=0.00602, 2500=0.00522 (USD); RoHS: Yes; Case/Package: 0603; Number of Pins: 2; Weight: 7.1E-05oz; Case Code (Imperial): 0603; Case Code (Metric): 1608; Min Operating Temperature: -55°C; Max Operating Temperature: 155°C; Tolerance: 1%; Composition: Thick Film; Packaging: Tape and Reel; Military Standard: Not; Voltage Rating: 75V; Termination: SMD/SMT; Length: 1.55mm; Height: 0.45mm; Width: 0.033inch; Depth: 0.85mm; REACH SVHC: Unknown; Lead Free: Lead Free; ComponentLink1URL: https://datasheet.ciiva.com/11809/0900766b80d98afc-11809037.pdf?src-supplier=RSComponents; ComponentLink1Description: https://datasheet.ciiva.com/11809/0900766b80d98afc-11809037.pdf?src-supplier=RSComponents; ComponentLink2URL: https://datasheet.ciiva.com/16886/dcrcw-16886037.pdf?src-supplier=Avnet+Europe; ComponentLink2Description: https://datasheet.ciiva.com/16886/dcrcw-16886037.pdf?src-supplier=Avnet+Europe; ComponentLink3URL: https://datasheet.ciiva.com/26821/getdatasheetpartid-86831-26821109.pdf?src-supplier=Verical; ComponentLink3Description: https://datasheet.ciiva.com/26821/getdatasheetpartid-86831-26821109.pdf?src-supplier=Verical; ComponentLink4URL: https://datasheet.ciiva.com/16754/70201119-16754710.pdf?src-supplier=Allied+Electronics; ComponentLink4Description: https://datasheet.ciiva.com/16754/70201119-16754710.pdf?src-supplier=Allied+Electronics; ComponentLink5URL: https://datasheet.ciiva.com/16719/70201119-16719704.pdf?src-supplier=Allied+Electronics; ComponentLink5Description: https://datasheet.ciiva.com/16719/70201119-16719704.pdf?src-supplier=Allied+Electronics; ComponentLink6URL: https://datasheet.ciiva.com/2465/dcrcwe3-2465513.pdf?src-supplier=Digi-Key; ComponentLink6Description: https://datasheet.ciiva.com/2465/dcrcwe3-2465513.pdf?src-supplier=Digi-Key; Supplier Part Number 1: 541-10.0KHCT-ND; Manufacturer Part Number: CRCW060310K0FKEA; Category: Chip SMD Resistors; Contact Plating: Tin,Lead; Package Quantity: 10; Number of Terminations: 2; Max Power Dissipation: 100mW; Features: Automotive AEC-Q200; Radiation Hardening: No; ComponentLink7URL: https://datasheet.ciiva.com/5543/dcrcwe3-109170-5543001.pdf?src-supplier=Mouser; ComponentLink7Description: https://datasheet.ciiva.com/5543/dcrcwe3-109170-5543001.pdf?src-supplier=Mouser; ComponentLink8URL: https://datasheet.ciiva.com/2465/dcrcwe3-2465514.pdf?src-supplier=Digi-Key; ComponentLink8Description: https://datasheet.ciiva.com/2465/dcrcwe3-2465514.pdf?src-supplier=Digi-Key; ComponentLink9URL: https://datasheet.ciiva.com/46385/1697337-46385498.pdf?src-supplier=Element14; ComponentLink9Description: https://datasheet.ciiva.com/46385/1697337-46385498.pdf?src-supplier=Element14; ComponentLink10URL: https://datasheet.ciiva.com/2465/dcrcwe3-2465515.pdf?src-supplier=Digi-Key; ComponentLink10Description: https://datasheet.ciiva.com/2465/dcrcwe3-2465515.pdf?src-supplier=Digi-Key; ComponentLink11URL: https://datasheet.ciiva.com/3256/dcrcwe3-3256939.pdf?src-supplier=Avnet; ComponentLink11Description: https://datasheet.ciiva.com/3256/dcrcwe3-3256939.pdf?src-supplier=Avnet; ComponentLink12Description: https://datasheet.ciiva.com/3256/dcrcwe3-3256940.pdf?src-supplier=Avnet; ComponentLink12URL: https://datasheet.ciiva.com/3256/dcrcwe3-3256940.pdf?src-supplier=Avnet; ComponentLink13Description: https://datasheet.ciiva.com/16209/dcrcwe3-16209164.pdf?src-supplier=Future+Electronics; ComponentLink13URL: https://datasheet.ciiva.com/16209/dcrcwe3-16209164.pdf?src-supplier=Future+Electronics; ComponentLink14Description: https://datasheet.ciiva.com/26314/fld-crcw-e3-data-en-26314749.pdf?src-supplier=Distrelec; ComponentLink14URL: https://datasheet.ciiva.com/26314/fld-crcw-e3-data-en-26314749.pdf?src-supplier=Distrelec
R6 R7 = CRCW06034K70FKTA: RES SMD 4.7K OHM 1% 1/10W 0603; Manufacturer 1: Vishay Dale; Resistance: 4.7kR; Temperature Coefficient: 100ppm/°C; Power Rating: 100mW; Voltage Rating: 75V; Supplier 1: Mouser; Manufacturer Part Number 1: CRCW06034K70FKTA; RoHS: Yes; Category: Chip SMD Resistors; Stock 1: 10790; Pricing 1: 1=0,14000, 10=0,12400, 100=0,04700, 1000=0,01800, 5000=0,01400, 10000=0,01300, 25000=0,01200, 50000=0,01100 (USD); Case/Package: 0603; Weight: 7.1E-05oz; Case Code (Metric): 1608; Case Code (Imperial): 0603; Contact Plating: Tin,Lead; Min Operating Temperature: -55°C; Max Operating Temperature: 155°C; Tolerance: 1%; Packaging: Tape and Reel; Composition: Thick Film; Voltage Rating (DC): 75V; Number of Terminations: 2; Max Power Dissipation: 100mW; Military Standard: Not; Package Quantity: 5000; Features: Automotive AEC-Q200; Power Dissipation: 100mW; Length: 1.55mm; Height: 0.02inch; Width: 0.033inch; Depth: 0.85mm; Radiation Hardening: No; Lead Free: Contains Lead; ComponentLink1URL: https://datasheet.ciiva.com/2565/dcrcw-2565426.pdf?src-supplier=Digi-Key; ComponentLink1Description: https://datasheet.ciiva.com/2565/dcrcw-2565426.pdf?src-supplier=Digi-Key; ComponentLink2URL: https://datasheet.ciiva.com/9071/dcrcw-9071351.pdf?src-supplier=Avnet; ComponentLink2Description: https://datasheet.ciiva.com/9071/dcrcw-9071351.pdf?src-supplier=Avnet; Supplier Part Number 1: 71-CRCW0603-4.7K
R9 = CRCW0603470RFKEAHP: RES SMD 470 OHM 1% 1/10W 0603; Manufacturer: Vishay; Temperature Coefficient: 100ppm/°C; Voltage Rating: 75V; Power Rating: 250mW; Supplier 1: Digi-Key; Stock 1: 42034; Pricing 1: 1=0.16000, 10=0.13600, 100=0.05330, 1000=0.02232, 2500=0.02046 (USD); RoHS: Yes; Case/Package: 0603; Resistance: 470R; Tolerance: 1%; Lead Free: Lead Free; Supplier Part Number 1: 541-470SCT-ND; Manufacturer Part Number: CRCW0603470RFKEAHP; Category: Chip SMD Resistors; Mount: Surface Mount; Contact Plating: Tin; Case Code (Metric): 1608; Case Code (Imperial): 0603; Min Operating Temperature: -55°C; Max Operating Temperature: 155°C; Composition: Thick Film; Number of Terminations: 2; Termination: SMD/SMT; Military Standard: Not; Package Quantity: 1; Packaging: Tape and Reel; Features: Automotive AEC-Q200; Voltage Rating (DC): 75V; Max Power Dissipation: 250mW; Length: 1.6mm; Height: 0.022inch; Depth: 0.85mm; Width: 0.033inch; Radiation Hardening: No; REACH SVHC: Unknown; ComponentLink1URL: https://datasheet.ciiva.com/8934/crcwhpe3-8934713.pdf?src-supplier=Avnet; ComponentLink1Description: https://datasheet.ciiva.com/8934/crcwhpe3-8934713.pdf?src-supplier=Avnet; ComponentLink2URL: https://datasheet.ciiva.com/16884/crcwhpe3-16884505.pdf?src-supplier=Avnet+Europe; ComponentLink2Description: https://datasheet.ciiva.com/16884/crcwhpe3-16884505.pdf?src-supplier=Avnet+Europe; ComponentLink3URL: https://datasheet.ciiva.com/7777/424479-7777323.pdf?src-supplier=Element14; ComponentLink3Description: https://datasheet.ciiva.com/7777/424479-7777323.pdf?src-supplier=Element14; ComponentLink4URL: https://datasheet.ciiva.com/7777/424479-7777324.pdf?src-supplier=Element14; ComponentLink4Description: https://datasheet.ciiva.com/7777/424479-7777324.pdf?src-supplier=Element14
S1 = KMR441NGLFS: Manufacturer: ITT C&K; Mechanical Life: 100000Cycles; Voltage Rating (DC): 32V; Current Rating: 50mA; Power Rating: 1W; Operating Force: 4N; Switch Function: Off-Mom; Switch Travel: 0.35mm; Actuator Type: Standard; Illumination Type: Non-Illuminated,Illuminated; Actuator Length: 1.1mm; Supplier 1: Mouser; Supplier Part Number 1: 611-KMR441NGLFS; Manufacturer Part Number: KMR441NGLFS; RoHS: Yes; Category: Tactile Switches; Stock 1: 6000; Pricing 1: 1=0.99000, 10=0.95100, 25=0.93300, 50=0.89700, 100=0.77400, 250=0.70600 (USD); Mount: Surface Mount; Case/Package: SMD/SMT; Contact Material: Silver; Contact Plating: Silver; Min Operating Temperature: -40°C; Max Operating Temperature: 85°C; Orientation: Straight; Packaging: Tape and Reel; Package Quantity: 6000; Termination: Gull Wing; Max Voltage Rating (DC): 32V; Throw Configuration: SPST; Max Current Rating: 50mA; Length: 2.8mm; Depth: 4.6mm; Radiation Hardening: No; REACH SVHC: No SVHC; ComponentLink1URL: https://datasheet.ciiva.com/2900/kmr4-9aug12-2900281.pdf?src-supplier=Digi-Key; ComponentLink1Description: https://datasheet.ciiva.com/2900/kmr4-9aug12-2900281.pdf?src-supplier=Digi-Key; ComponentLink2URL: https://datasheet.ciiva.com/7986/1443639-7986953.pdf?src-supplier=Element14; ComponentLink2Description: https://datasheet.ciiva.com/7986/1443639-7986953.pdf?src-supplier=Element14; ComponentLink3URL: https://datasheet.ciiva.com/2900/kmr4-9aug12-2900282.pdf?src-supplier=Digi-Key; ComponentLink3Description: https://datasheet.ciiva.com/2900/kmr4-9aug12-2900282.pdf?src-supplier=Digi-Key; ComponentLink4URL: https://datasheet.ciiva.com/2900/kmr4-9aug12-2900283.pdf?src-supplier=Digi-Key; ComponentLink4Description: https://datasheet.ciiva.com/2900/kmr4-9aug12-2900283.pdf?src-supplier=Digi-Key; ComponentLink5URL: https://datasheet.ciiva.com/16696/kmr4-9aug12-16696492.pdf?src-supplier=Avnet+Europe; ComponentLink5Description: https://datasheet.ciiva.com/16696/kmr4-9aug12-16696492.pdf?src-supplier=Avnet+Europe
SB1 = SB_3P: Solder Bridge smd
SB2-SB4 = SB_2P: Solder Bridge smd
screw1-screw3 = screw_M2
TP1-TP15 = TP SMD
U1 = TPS22919DCKR: 5.5-V, 1.5-A, 90-mΩ load switch with adj. output discharge 6-SC70 -40 to 105; Manufacturer: Texas Instruments; Supplier 1: Digi-Key; Supplier Part Number 1: 296-TPS22919DCKRCT-ND; Manufacturer Part Number: TPS22919DCKR; RoHS: Yes; Stock 1: 68498; Pricing 1: 1=0.39000, 10=0.29100, 25=0.26240, 100=0.14310, 250=0.13832, 500=0.12402, 1000=0.09540 (USD); RoHS Compliant: Yes
U2 = CMWX1ZZABZ-078: LORA MODULE; Manufacturer 1: Murata; Interface: I2C,SPI,USB,UART; Frequency: 915MHz; Sensitivity: -133dBm; Current - Receiving: 23mA; Current - Transmitting: 106mA; Supplier 1: Mouser; Stock 1: 1484; Pricing 1: 1=16,54000, 10=13,78000, 50=13,78000, 100=12,60000, 200=11,75000, 500=11,54000 (USD); RoHS: No; Mount: Surface Mount; Case/Package: Module; Min Operating Temperature: -40°C; Max Operating Temperature: 85°C; Packaging: Cut Tape; ComponentLink1URL: https://wireless.murata.com/RFM/data/type_abz.pdf?src-supplier=Digi-Key; ComponentLink1Description: https://wireless.murata.com/RFM/data/type_abz.pdf?src-supplier=Digi-Key; Supplier Part Number 1: 81-CMWX1ZZABZ-078; Manufacturer Part Number 1: CMWX1ZZABZ-078
U3 = RP605K333B-TR: Manufacturer: Ricoh; Supplier 1: Mouser; Supplier Part Number 1: 848-RP605K333B-TR; Manufacturer Part Number: RP605K333B-TR; RoHS: No; Stock 1: 4115; Pricing 1: 1=2.24000, 10=1.90000, 50=1.90000, 100=1.52000, 1000=1.11000, 10000=0.98800 (USD)
U4 = TPS3839K33DBZR: IC LP SUPERVISRY CIRCUIT SOT23-3; Manufacturer: Texas Instruments; Max Supply Voltage: 6.5V; Min Supply Voltage: 900mV; Number of Monitored Inputs: 1; Reset: Active Low; Reset Timeout: 120ms; Threshold Voltage: 2.93V; Max Supply Current: 500nA; Watchdog Timer: No; Min Reset Threshold Voltage: 2.857V; Max Reset Threshold Voltage: 2.974V; Quiescent Current: 150nA; Output: TOTEM-POLE; Supplier 1: Mouser; Supplier Part Number 1: 595-TPS3839K33DBZR; Manufacturer Part Number: TPS3839K33DBZR; RoHS: Yes; Category: Voltage Supervisors; Stock 1: 776; Pricing 1: 1=0.70000, 10=0.57400, 50=0.57400, 100=0.43500, 1000=0.26900, 10000=0.25000 (USD); Mount: Surface Mount; Case/Package: SOT-23; Number of Pins: 3; Min Operating Temperature: -40°C; Max Operating Temperature: 85°C; Packaging: Tape and Reel; Type: Simple Reset/Power-On Reset; Package Quantity: 1; Number of Voltages Monitored: 1; Series: TPS3839K33; Radiation Hardening: No; REACH SVHC: No SVHC; Lead Free: Lead Free; RoHS Compliant: Yes; ComponentLink1URL: https://datasheet.ciiva.com/15105/getdatasheetpartid-682590-15105743.pdf?src-supplier=Verical; ComponentLink1Description: https://datasheet.ciiva.com/15105/getdatasheetpartid-682590-15105743.pdf?src-supplier=Verical; ComponentLink2URL: https://datasheet.ciiva.com/6602/tps3839k33-6602670.pdf?src-supplier=Digi-Key; ComponentLink2Description: https://datasheet.ciiva.com/6602/tps3839k33-6602670.pdf?src-supplier=Digi-Key; ComponentLink3URL: https://datasheet.ciiva.com/6602/tps3839k33-6602669.pdf?src-supplier=Digi-Key; ComponentLink3Description: https://datasheet.ciiva.com/6602/tps3839k33-6602669.pdf?src-supplier=Digi-Key; ComponentLink4URL: https://datasheet.ciiva.com/6602/tps3839k33-6602671.pdf?src-supplier=Digi-Key; ComponentLink4Description: https://datasheet.ciiva.com/6602/tps3839k33-6602671.pdf?src-supplier=Digi-Key
U5 = BME680: Pressure, Temperature and Humidity Sensor Digital Output 1.8V 8-Pin LGA; Manufacturer: Bosch Sensortec; Output Type: SPI,I2C; Supplier 1: Digi-Key; Supplier Part Number 1: 828-1077-1-ND; Manufacturer Part Number: BME680; RoHS: No; Category: Temperature and Humidity Sensors; Stock 1: 4127; Pricing 1: 1=12.14000, 5=10.65000, 10=9.58500, 25=8.52000, 50=7.88100, 100=6.81600, 500=6.39000, 1000=5.96400 (USD); Min Operating Temperature: -40°C; Max Operating Temperature: 85°C; Sensor Type: Temperature; ComponentLink1URL: https://ae-bst.resource.bosch.com/media/_tech/media/application_notes/BST-BME680-HS000-05.pdf?src-supplier=Digi-Key; ComponentLink1Description: https://ae-bst.resource.bosch.com/media/_tech/media/application_notes/BST-BME680-HS000-05.pdf?src-supplier=Digi-Key; ComponentLink2URL: https://ae-bst.resource.bosch.com/media/_tech/media/product_flyer/BST-BME680-FL000.pdf?src-supplier=Digi-Key; ComponentLink2Description: https://ae-bst.resource.bosch.com/media/_tech/media/product_flyer/BST-BME680-FL000.pdf?src-supplier=Digi-Key